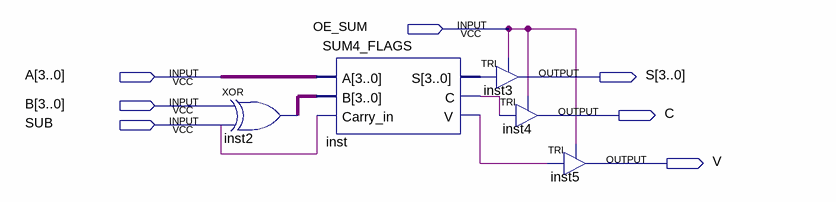
[diagram p0: schematic sheet]
// Quartus schematic SUM_REST4.bdf as structural Verilog: 5 symbols, 7 pins
module SUM_REST4 (
  input  OE_SUM,
  input  [3:0] A,
  input  [3:0] B,
  input  SUB,
  output [3:0] S,
  output C,
  output V
);

  wire inst_c, inst_v;
  wire [3:0] inst2_out, inst_s;

  assign inst2_out = B ^ {4{SUB}};  // XOR inst2, 4 bits wide
  SUM4_FLAGS inst (.Carry_in(SUB), .A(A), .B(inst2_out), .S(inst_s), .C(inst_c), .V(inst_v));
  TRI inst3[3:0] (.IN(inst_s), .OE(OE_SUM), .OUT(S));
  TRI inst4 (.IN(inst_c), .OE(OE_SUM), .OUT(C));
  TRI inst5 (.IN(inst_v), .OE(OE_SUM), .OUT(V));
endmodule
